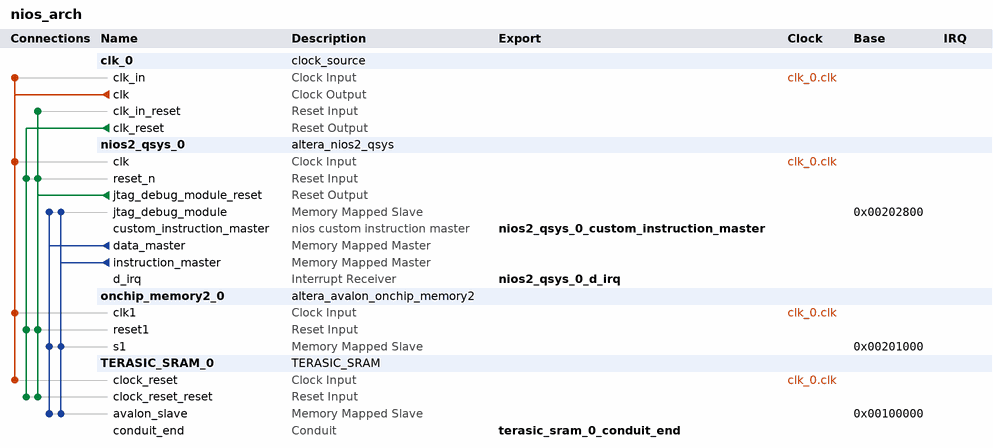
[diagram p0: system contents]
# Platform Designer (Qsys) system nios_arch, Cyclone V 5CGXFC5C6F27C7
# Parameters at their usual value, and those the tool derives, are not listed.
package require -exact qsys 18.0
create_system nios_arch
set_project_property DEVICE_FAMILY {Cyclone V}
set_project_property DEVICE 5CGXFC5C6F27C7

add_instance clk_0 clock_source 18.0
set_instance_parameter_value clk_0 clockFrequency 50000000

add_instance nios2_qsys_0 altera_nios2_qsys 16.1
set_instance_parameter_value nios2_qsys_0 breakSlave nios2_qsys_0.jtag_debug_module
set_instance_parameter_value nios2_qsys_0 exceptionSlave TERASIC_SRAM_0.avalon_slave
set_instance_parameter_value nios2_qsys_0 icache_size 4096
set_instance_parameter_value nios2_qsys_0 impl Tiny
set_instance_parameter_value nios2_qsys_0 mmu_TLBMissExcSlave None
set_instance_parameter_value nios2_qsys_0 resetSlave TERASIC_SRAM_0.avalon_slave
set_instance_parameter_value nios2_qsys_0 resetrequest_enabled true

add_instance onchip_memory2_0 altera_avalon_onchip_memory2 18.0
set_instance_parameter_value onchip_memory2_0 dataWidth 32
set_instance_parameter_value onchip_memory2_0 dualPort false
set_instance_parameter_value onchip_memory2_0 initMemContent true
set_instance_parameter_value onchip_memory2_0 initializationFileName onchip_mem.hex
set_instance_parameter_value onchip_memory2_0 memorySize 4096

add_instance TERASIC_SRAM_0 TERASIC_SRAM 1.0
set_instance_parameter_value TERASIC_SRAM_0 ADDR_BITS 20
set_instance_parameter_value TERASIC_SRAM_0 DATA_BITS 16

# connections
add_connection clk_0.clk clk_0.clk_in clock
add_connection clk_0.clk nios2_qsys_0.clk clock
add_connection clk_0.clk onchip_memory2_0.clk1 clock
add_connection clk_0.clk TERASIC_SRAM_0.clock_reset clock
add_connection clk_0.clk_reset nios2_qsys_0.reset_n reset
add_connection clk_0.clk_reset onchip_memory2_0.reset1 reset
add_connection clk_0.clk_reset TERASIC_SRAM_0.clock_reset_reset reset
add_connection nios2_qsys_0.jtag_debug_module_reset clk_0.clk_in_reset reset
add_connection nios2_qsys_0.jtag_debug_module_reset nios2_qsys_0.reset_n reset
add_connection nios2_qsys_0.jtag_debug_module_reset onchip_memory2_0.reset1 reset
add_connection nios2_qsys_0.jtag_debug_module_reset TERASIC_SRAM_0.clock_reset_reset reset
add_connection nios2_qsys_0.data_master nios2_qsys_0.jtag_debug_module avalon
set_connection_parameter_value nios2_qsys_0.data_master/nios2_qsys_0.jtag_debug_module baseAddress 0x00202800
add_connection nios2_qsys_0.data_master onchip_memory2_0.s1 avalon
set_connection_parameter_value nios2_qsys_0.data_master/onchip_memory2_0.s1 baseAddress 0x00201000
add_connection nios2_qsys_0.data_master TERASIC_SRAM_0.avalon_slave avalon
set_connection_parameter_value nios2_qsys_0.data_master/TERASIC_SRAM_0.avalon_slave baseAddress 0x00100000
add_connection nios2_qsys_0.instruction_master nios2_qsys_0.jtag_debug_module avalon
set_connection_parameter_value nios2_qsys_0.instruction_master/nios2_qsys_0.jtag_debug_module baseAddress 0x00202800
add_connection nios2_qsys_0.instruction_master onchip_memory2_0.s1 avalon
set_connection_parameter_value nios2_qsys_0.instruction_master/onchip_memory2_0.s1 baseAddress 0x00201000
add_connection nios2_qsys_0.instruction_master TERASIC_SRAM_0.avalon_slave avalon
set_connection_parameter_value nios2_qsys_0.instruction_master/TERASIC_SRAM_0.avalon_slave baseAddress 0x00100000

# exported interfaces
add_interface nios2_qsys_0_custom_instruction_master nios_custom_instruction start
set_interface_property nios2_qsys_0_custom_instruction_master EXPORT_OF nios2_qsys_0.custom_instruction_master
add_interface nios2_qsys_0_d_irq interrupt receiver
set_interface_property nios2_qsys_0_d_irq EXPORT_OF nios2_qsys_0.d_irq
add_interface terasic_sram_0_conduit_end conduit end
set_interface_property terasic_sram_0_conduit_end EXPORT_OF TERASIC_SRAM_0.conduit_end

set_interconnect_requirement {$system} qsys_mm.clockCrossingAdapter HANDSHAKE
set_interconnect_requirement {$system} qsys_mm.enableEccProtection FALSE
set_interconnect_requirement {$system} qsys_mm.insertDefaultSlave FALSE
set_interconnect_requirement {$system} qsys_mm.maxAdditionalLatency 1

save_system nios_arch.qsys
